# Altium schematic sheet XC7A35TFTG256_IO.SchDoc
size A4; DocumentNumber: 17; SheetNumber: 17; SheetTotal: 21; SheetName: FPGA IO Top level
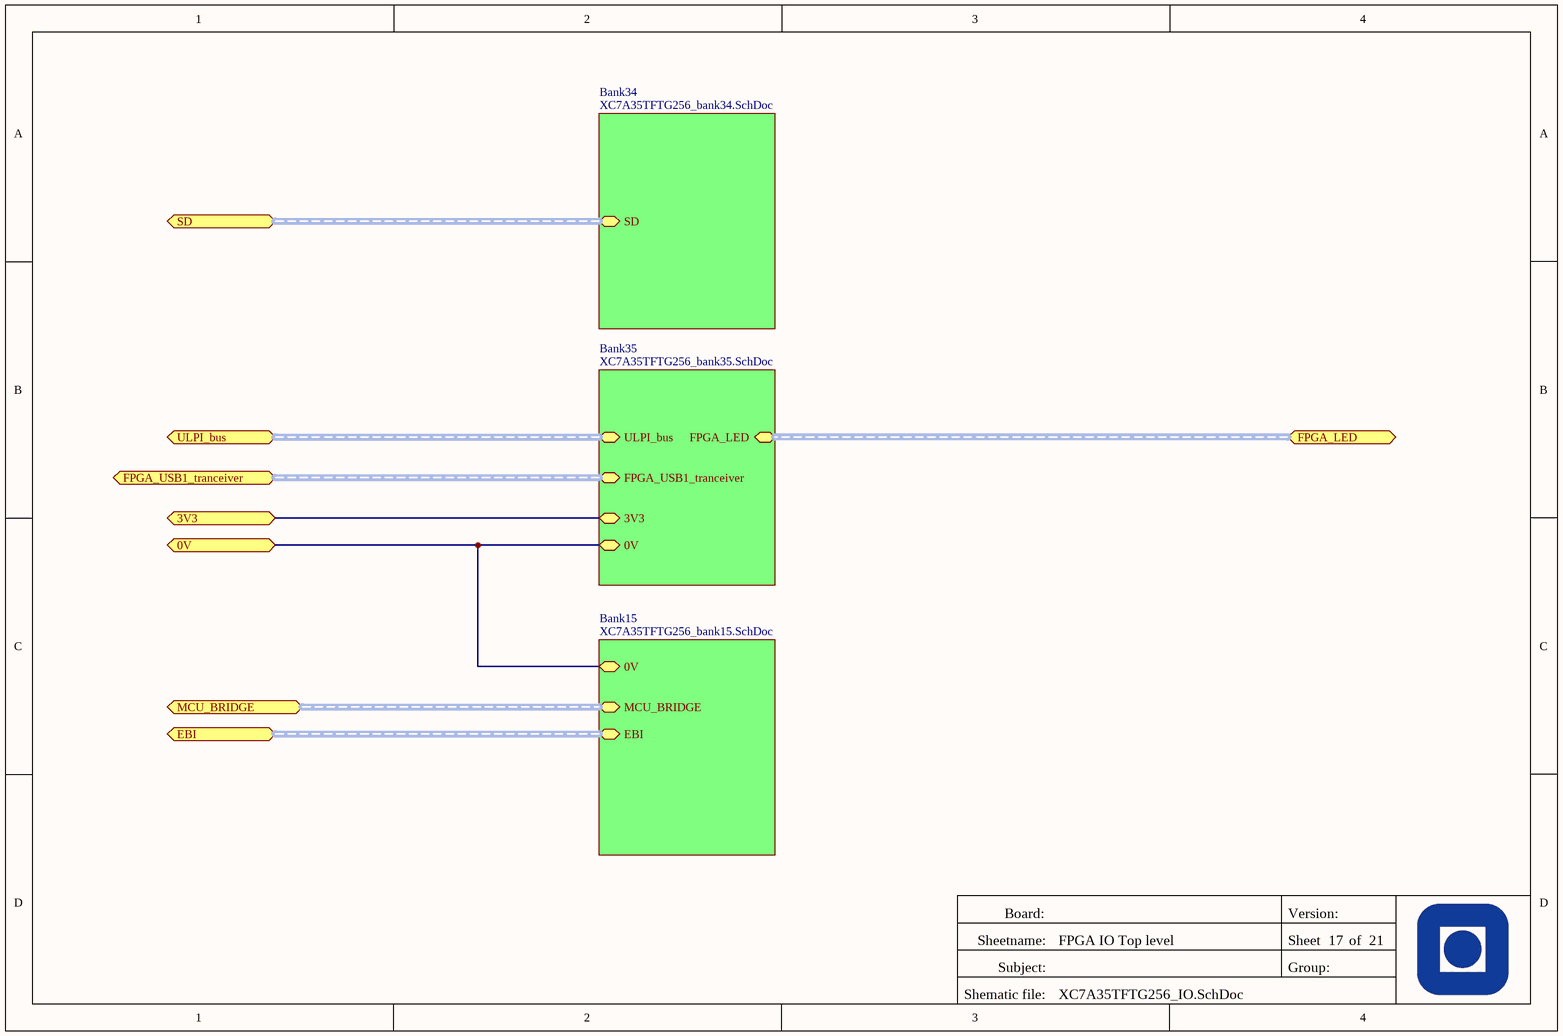
[diagram p0: XC7A35TFTG256_IO.SchDoc]

## Sub-sheets
Bank15 = XC7A35TFTG256_bank15.SchDoc: MCU_BRIDGE (harness MCU_CTRL_LOGIC), EBI (harness EBI), 0V
Bank34 = XC7A35TFTG256_bank34.SchDoc: SD (harness SD_card)
Bank35 = XC7A35TFTG256_bank35.SchDoc: ULPI_bus (harness ULPI), FPGA_USB1_tranceiver (harness USB1_FS_harness), FPGA_LED, 3V3, 0V

## Ports
0V, 3V3, EBI (harness EBI), FPGA_LED (harness LED_Harness), FPGA_USB1_tranceiver (harness USB1_FS_harness), MCU_BRIDGE (harness MCU_CTRL_LOGIC), SD (harness Sd_card), ULPI_bus (harness ULPI)

## Nets
0V: port 0V, sheet Bank15/0V, sheet Bank35/0V
3V3: port 3V3, sheet Bank35/3V3

## Buses and harness runs
harness port EBI = sheet Bank15/EBI
harness port FPGA_LED = sheet Bank35/FPGA_LED
harness port FPGA_USB1_tranceiver = sheet Bank35/FPGA_USB1_tranceiver
harness port MCU_BRIDGE = sheet Bank15/MCU_BRIDGE
harness port SD = sheet Bank34/SD
harness port ULPI_bus = sheet Bank35/ULPI_bus

## Notes on the sheet
- Board:
- Version:
- Sheetname:
- Subject:
- Group:
- Sheet
- of
- Shematic file: